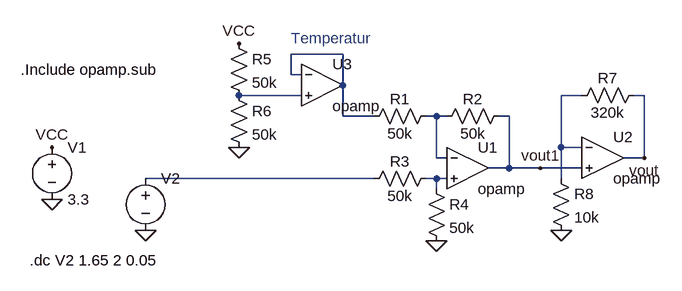
[diagram p0: schematic Temp.asc]
Temp.asc, the LTspice schematic file:
Version 4
SHEET 1 880 680
WIRE 64 -16 -16 -16
WIRE -16 16 -16 -16
WIRE 0 16 -16 16
WIRE 64 32 64 -16
WIRE 0 48 -96 48
WIRE 432 48 400 48
WIRE 528 48 512 48
WIRE 64 80 64 32
WIRE 112 80 64 80
WIRE 208 80 192 80
WIRE 224 80 208 80
WIRE 320 80 304 80
WIRE 400 128 400 48
WIRE 432 128 400 128
WIRE 208 144 208 80
WIRE 224 144 208 144
WIRE 528 144 528 48
WIRE 528 144 496 144
WIRE 320 160 320 80
WIRE 320 160 288 160
WIRE 368 160 320 160
WIRE 432 160 368 160
WIRE 112 176 -240 176
WIRE 208 176 192 176
WIRE 224 176 208 176
WIRE 400 176 400 128
WIRE 208 192 208 176
FLAG 208 272 0
FLAG -384 208 0
FLAG -384 128 VCC
FLAG -96 -32 VCC
FLAG -96 128 0
FLAG 400 256 0
FLAG 528 144 vout
FLAG -240 256 0
FLAG 368 160 vout1
SYMBOL res 208 64 R90
WINDOW 0 5 56 VBottom 2
WINDOW 3 27 56 VTop 2
SYMATTR InstName R1
SYMATTR Value 50k
SYMBOL res 320 64 R90
WINDOW 0 5 56 VBottom 2
WINDOW 3 27 56 VTop 2
SYMATTR InstName R2
SYMATTR Value 50k
SYMBOL res 192 176 R0
SYMATTR InstName R4
SYMATTR Value 50k
SYMBOL voltage -384 112 R0
WINDOW 123 0 0 Left 0
WINDOW 39 0 0 Left 0
SYMATTR InstName V1
SYMATTR Value 3.3
SYMBOL res -112 -48 R0
SYMATTR InstName R5
SYMATTR Value 50k
SYMBOL res -112 32 R0
SYMATTR InstName R6
SYMATTR Value 50k
SYMBOL res 528 32 R90
WINDOW 0 5 56 VBottom 2
WINDOW 3 27 56 VTop 2
SYMATTR InstName R7
SYMATTR Value 320k
SYMBOL res 384 160 R0
SYMATTR InstName R8
SYMATTR Value 10k
SYMBOL voltage -240 160 R0
WINDOW 123 0 0 Left 0
WINDOW 39 0 0 Left 0
SYMATTR InstName V2
SYMATTR Value ""
SYMBOL Opamps\\opamp 256 96 R0
SYMATTR InstName U1
SYMBOL Opamps\\opamp 464 80 R0
SYMATTR InstName U2
SYMBOL res 208 160 R90
WINDOW 0 5 56 VBottom 2
WINDOW 3 27 56 VTop 2
SYMATTR InstName R3
SYMATTR Value 50k
SYMBOL Opamps\\opamp 32 -32 R0
SYMATTR InstName U3
TEXT -16 -40 Left 2 ;Temperatur
TEXT -418 302 Left 2 !.dc V2 1.65 2 0.05
TEXT -432 8 Left 2 !.Include opamp.sub

The netlist it stands for:
* Temp.asc
R1 N004 N001 50k
R2 vout1 N004 50k
R4 N006 0 50k
V1 VCC 0 3.3
R5 VCC N002 50k
R6 N002 0 50k
R7 vout N003 320k
R8 N003 0 10k
V2 N005 0
XU1 N004 N006 vout1 opamp Aol=100K GBW=10Meg  ; pins invin noninvin out
XU2 N003 vout1 vout opamp Aol=100K GBW=10Meg  ; pins invin noninvin out
R3 N006 N005 50k
XU3 N001 N002 N001 opamp Aol=100K GBW=10Meg  ; pins invin noninvin out
* Temperatur
.dc V2 1.65 2 0.05
.Include opamp.sub
.backanno
.end